# EAGLE schematic AK-230_24-V3 (EAGLE 5.10)
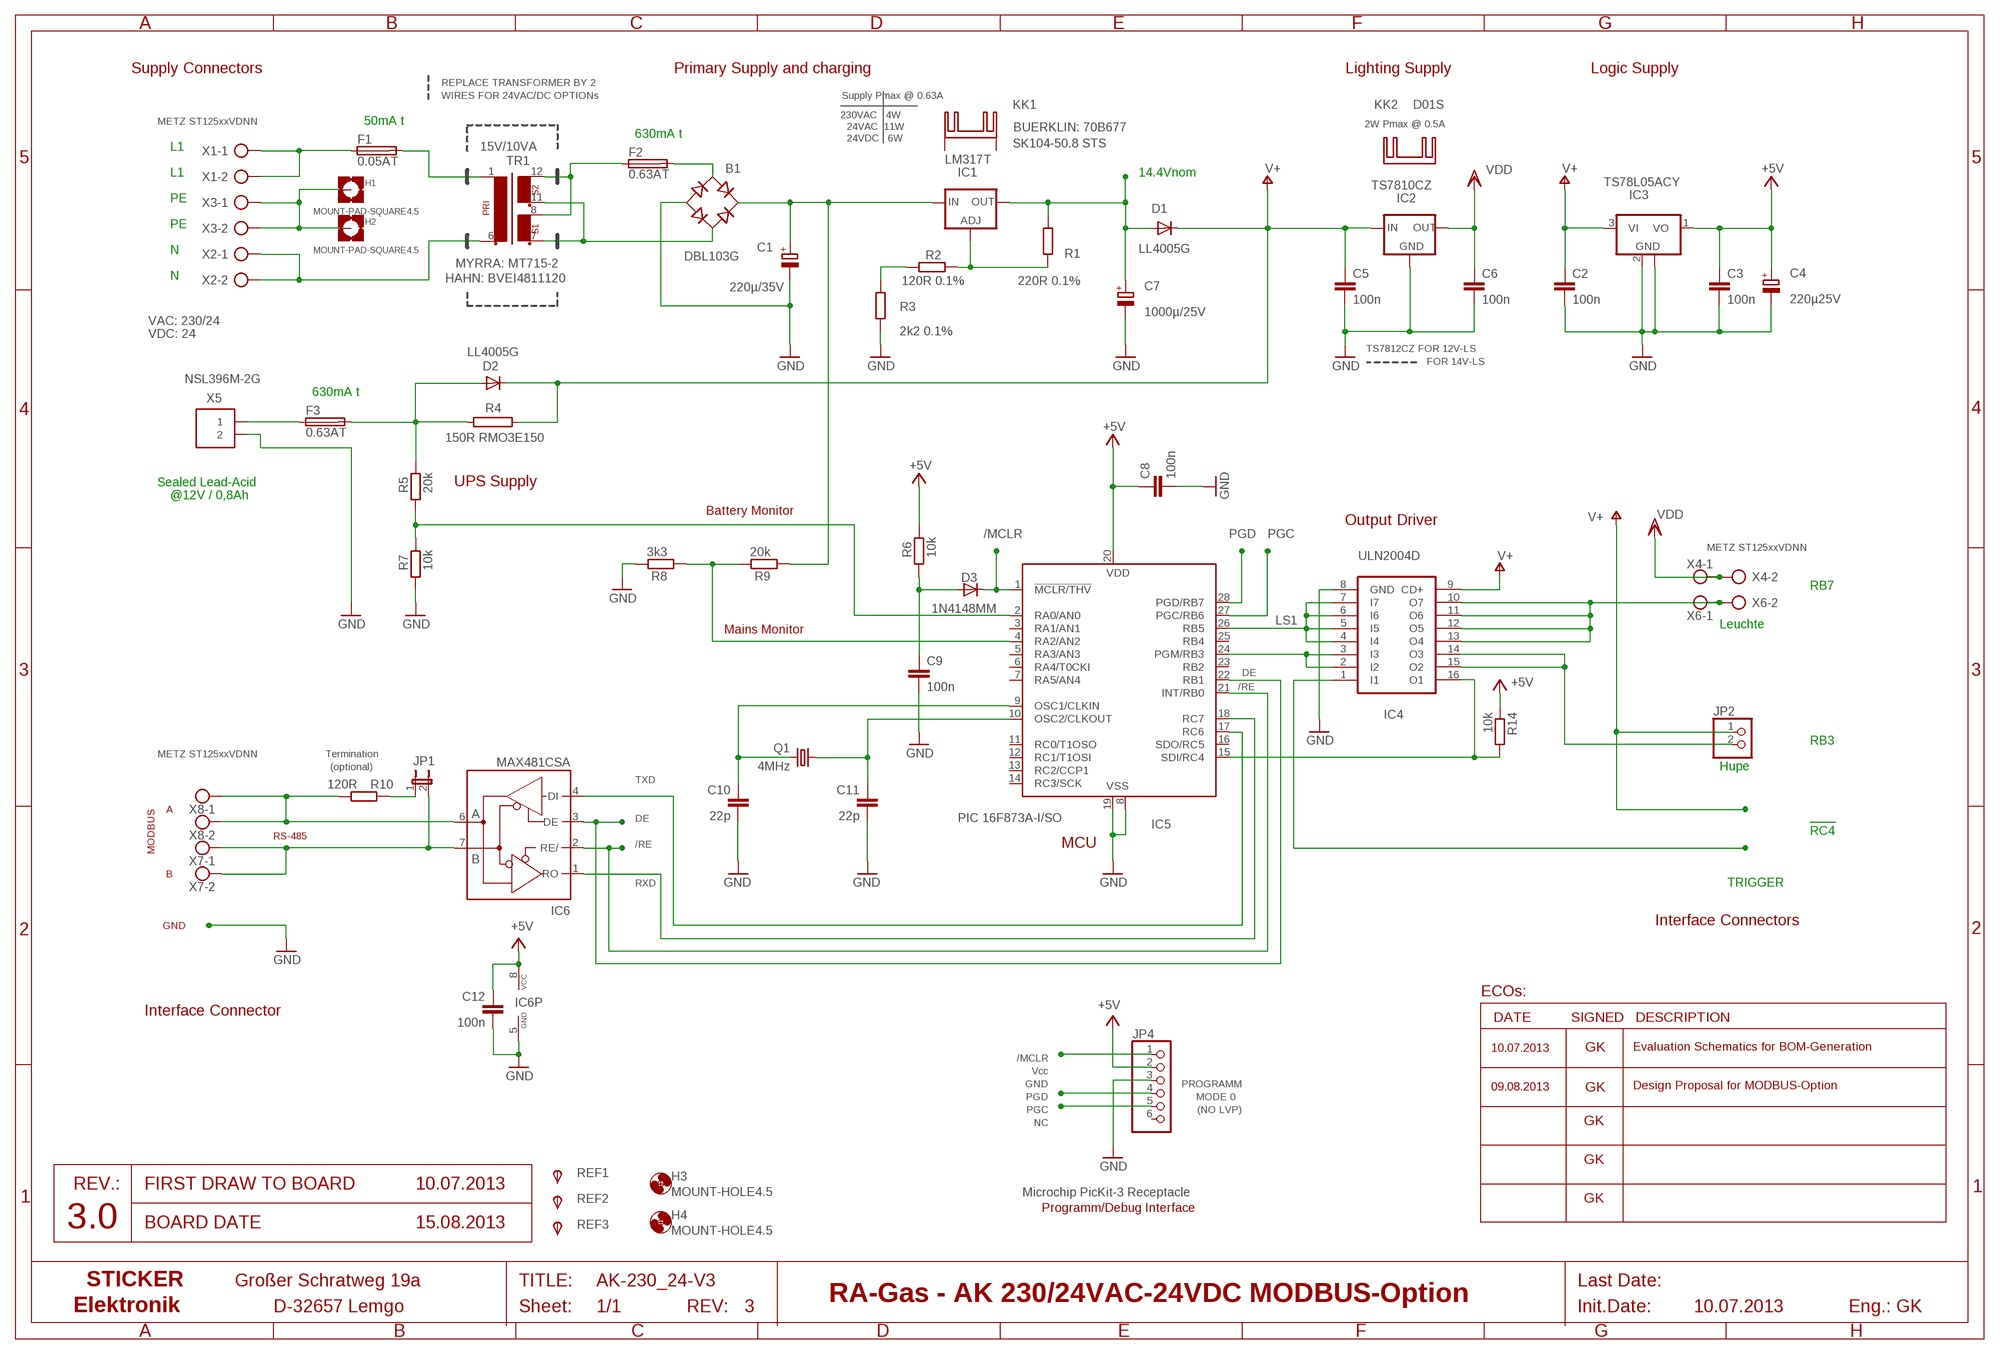
[diagram p0: schematic, sheet 1]

## Parts
B1  DBL103G  DBL203G  [DB]
C1  220µ/35V  CPOL-EUE5-10.5  [E5-10,5]
C2  100n  C-EUC1206  [C1206]
C3  100n  C-EUC1206  [C1206]
C4  220µ25V  CPOL-EUE3.5-8  [E3,5-8]
C5  100n  C-EUC1206  [C1206]
C6  100n  C-EUC1206  [C1206]
C7  1000µ/25V  CPOL-EUE5-10.5  [E5-10,5]
C8  100n  C-EUC1206  [C1206]
C9  100n  C-EUC1206  [C1206]
C10  22p  C-EUC0805  [C0805]
C11  22p  C-EUC0805  [C0805]
C12  100n  C-EUC1206  [C1206]
D1  LL4005G  DIODE-MELF-MLL41  [MELF-MLL41]
D2  LL4005G  DIODE-MELF-MLL41  [MELF-MLL41]
D3  1N4148MM  [MINIMELF@1]
F1  0.05AT  KS9V  [KS9V]
F2  0.63AT  KS9V  [KS9V]
F3  0.63AT  KS9V  [KS9V]
H1  MOUNT-PAD-SQUARE4.5  [4,5-PAD-SQUARE]
H2  MOUNT-PAD-SQUARE4.5  [4,5-PAD-SQUARE]
H3  MOUNT-HOLE4.5  [4,5]
H4  MOUNT-HOLE4.5  [4,5]
IC1  LM317T  LM317TS  [317TS]
IC2  TS7810CZ  78XXS  [78XXS]
IC3  TS78L05ACY  78L05F  [SOT89]
IC4  ULN2004D  ULN2004AD  [SO16]
IC5  PIC 16F873A-I/SO  PIC16873SO  [SO28W]
IC6  MAX481CSA  [SO08]
JP1  JP1E  [JP1]
JP2  PINHD-1X2  [1X02]
JP4  PINHD-1X6  [1X06]
KK1  SK104-50.8 STS  SK104-PAD  [SK104-PAD]
KK2  D01S  [D01S]
Q1  4MHz  CRYSTALHC49UP  [HC49UP]
R1  220R 0.1%  R-EU_R0805  [R0805]
R2  120R 0.1%  R-EU_R0805  [R0805]
R3  2k2 0.1%  R-EU_R0805  [R0805]
R4  150R RMO3E150  RKH206-8  [KH206-8]
R5  20k  R-EU_R1206  [R1206]
R6  10k  R-EU_R1206  [R1206]
R7  10k  R-EU_R1206  [R1206]
R8  3k3  R-EU_R1206  [R1206]
R9  20k  R-EU_R1206  [R1206]
R10  120R  R-EU_R1206  [R1206]
R14  10k  R-EU_R1206  [R1206]
REF1  TPSB1,27  [B1,27]
REF2  TPSB1,27  [B1,27]
REF3  TPSB1,27  [B1,27]
TR1  MYRRA: MT715-2  EI48-2B  [EI48-2B]
X1  AK500/2  [AK500/2]
X2  AK500/2  [AK500/2]
X3  AK500/2  [AK500/2]
X4  AK500/2  [AK500/2]
X5  NSL396M-2G  MKS1852-6-0-202  [MKS1852-6-0-202]
X6  AK500/2  [AK500/2]
X7  AK500/2  [AK500/2]
X8  AK500/2  [AK500/2]

## Nets
+5V: C3.1 C4.+ C8.1 C12.1 IC3.1(VO) IC5.20(VDD) IC6.8(VCC) JP4.2 R6.2 R14.1
/MCLR: D3.C IC5.1(!MCLR/THV) JP4.1
/RE: IC5.21(INT/RB0) IC6.2(RE/)
A: IC6.6(A) R10.2 X8.1 X8.2
B: IC6.7(B) JP1.2 X7.1 X7.2
DE: IC5.22(RB1) IC6.3(DE)
GND: B1.- C1.- C2.2 C3.2 C4.- C5.2 C6.2 C7.- C8.2 C9.2 C10.2 C11.2 C12.2 IC2.GND IC3.2(GND) IC3.2@1(GND) IC4.8(GND) IC5.8(VSS) IC5.19(VSS) IC6.5(GND) JP4.3 R3.1 R7.1 R8.2 X5.2
LS1: IC4.4(I4) IC4.5(I5) IC4.6(I6) IC4.7(I7) IC5.26(RB5)
N$1: B1.AC1 TR1.7 TR1.11
N$2: F2.1 TR1.8 TR1.12
N$4: F1.1 X1.1 X1.2
N$6: TR1.6 X2.1 X2.2
N$7: B1.+ C1.+ IC1.3(IN) R9.1
N$8: D2.A F3.2 R4.1 R5.2
N$9: F3.1 X5.1
N$10: IC1.1(ADJ) R1.1 R2.2
N$11: F1.2 TR1.1
N$12: C7.+ D1.A IC1.2(OUT) R1.2
N$13: R2.1 R3.2
N$14: B1.AC2 F2.2
N$18: JP1.1 R10.1
N$19: IC4.2(I2) IC4.3(I3) IC5.24(PGM/RB3)
N$22: C9.1 D3.A R6.1
N$23: C11.1 IC5.10(OSC2/CLKOUT) Q1.1
N$24: IC5.2(RA0/AN0) R5.1 R7.2
N$25: IC4.10(O7) IC4.11(O6) IC4.12(O5) IC4.13(O4) X6.1 X6.2
N$26: C10.1 IC5.9(OSC1/CLKIN) Q1.2
N$29: IC4.14(O3) IC4.15(O2) JP2.2
N$30: IC4.16(O1) IC5.15(SDI/RC4) R14.2
N$40: IC5.4(RA2/AN2) R8.1 R9.2
PE: H1.B4,5(MOUNT) H2.B4,5(MOUNT) X3.1 X3.2
PGC: IC5.27(PGC/RB6) JP4.5
PGD: IC5.28(PGD/RB7) JP4.4
RXD: IC5.18(RC7) IC6.1(RO)
TRIG: IC4.1(I1)
TXD: IC5.17(RC6) IC6.4(DI)
V+: C2.1 C5.1 D1.C D2.C IC2.IN IC3.3(VI) IC4.9(CD+) JP2.1 R4.2
VDD: C6.1 IC2.OUT X4.1 X4.2
Unconnected: IC5.3(RA1/AN1) IC5.5(RA3/AN3) IC5.6(RA4/T0CKI) IC5.7(RA5/AN4) IC5.11(RC0/T1OSO) IC5.12(RC1/T1OSI) IC5.13(RC2/CCP1) IC5.14(RC3/SCK) IC5.16(SDO/RC5) IC5.23(RB2) IC5.25(RB4) JP4.6 KK1.K1(K) KK1.K2(K) REF1.TP(PP) REF2.TP(PP) REF3.TP(PP)

## Notes on the sheet
- Supply Connectors | Primary Supply and charging | Lighting Supply | Logic Supply
- REPLACE TRANSFORMER BY 2
- WIRES FOR 24VAC/DC OPTIONs | Supply Pmax @ 0.63A
- 230VAC   4W
- METZ ST125xxVDNN | 50mA t | 2W Pmax @ 0.5A
- 24VAC  11W | BUERKLIN: 70B677
- 630mA t
- 24VDC   6W
- L1 | 15V/10VA
- L1 | 14.4Vnom
- PE
- PE
- N
- N | HAHN: BVEI4811120
- VAC: 230/24
- VDC: 24
- TS7812CZ FOR 12V-LS
- FOR 14V-LS
- 630mA t
- Sealed Lead-Acid | UPS Supply
- @12V / 0,8Ah
- Battery Monitor
- Output Driver
- METZ ST125xxVDNN
- RB7
- Leuchte
- Mains Monitor
- RB3
- METZ ST125xxVDNN | Termination
- (optional) | Hupe
- A
- RS-485 | RC4
- MCU
- MODBUS
- B
- TRIGGER
- Interface Connectors
- GND
- ECOs:
- Interface Connector
- DATE | SIGNED | DESCRIPTION
- 10.07.2013 | GK | Evaluation Schematics for BOM-Generation
- Vcc
- GND | PROGRAMM
- 09.08.2013 | GK | Design Proposal for MODBUS-Option
- MODE 0
- (NO LVP)
- NC
- GK
- GK
- REV.: | FIRST DRAW TO BOARD | 10.07.2013
- Microchip PicKit-3 Receptacle
- GK
- Programm/Debug Interface
- 3.0 | BOARD DATE | 15.08.2013
- RA-Gas - AK 230/24VAC-24VDC MODBUS-Option
- 3 | 10.07.2013

## Library data of the parts
B1 = rectifier:DB?*G: Single Phase 1.0 AMP Glass Passivated Bridge Rectifier Taiwan Semiconductor Co.,Ltd. - TSC Source: http://www.taiwansemi.com/TSCbig5/ezcatfiles/cust/img/img/db101g.pdf http://www.ts.com.tw/db/pictures/modules/PDT/PDT060207001/DBLS201G.pdf
C1 C4 C7 = rcl:CPOL-EU: POLARIZED CAPACITOR, European symbol
C2 C3 C5 C6 C8-C12 = rcl:C-EU: CAPACITOR, European symbol
D1 D2 = diode:DIODE-: DIODE
D3 = diode:1N4148: DIODE high speed (Philips)
F1-F3 = fuse:KS9V: FUSE HOLDER CS, Schukat
H1 H2 = holes:MOUNT-PAD-SQUARE: MOUNTING PAD, square
H3 H4 = holes:MOUNT-HOLE: MOUNTING HOLE with drill center marker
IC1 = v-reg:LM317TS: VOLTAGE REGULATOR
IC2 = v-reg:78XXS: VOLTAGE REGULATOR
IC3 = linear:78L*: POSITOIV-VOLTAGE REGULATORS Output up to 100 mA Source: http://focus.ti.com/lit/ds/symlink/ua78l05.pdf
IC4 = uln-udn:ULN2004A: DRIVER ARRAY
IC5 = microchip:PIC16*873: MICROCONTROLLER flash type
IC6 = maxim:MAX481CSA: RS485 TRANSEIVER
JP1 = jumper:JP1E: JUMPER
JP2 = pinhead:PINHD-1X2: PIN HEADER
JP4 = pinhead:PINHD-1X6: PIN HEADER
KK1 = heatsink:SK104-PAD: HEATSINK manufacturer Fischer/distributor Buerklin
KK2 = heatsink:D01S: HEATSINK distributor Schukat
Q1 = crystal:CRYSTAL: CRYSTAL
R1-R3 R5-R10 R14 = rcl:R-EU_: RESISTOR, European symbol
R4 = resistor-power:R: Power Resitor
REF1-REF3 = testpad:TPS: TEST PIN
TR1 = trafo:EI48-2B: TRANSFORMER 1 primary winding, 2 secondary windings, mounting holes ERA
X1-X4 X6-X8 = con-ptr500:AK500/2: CONNECTOR
X5 = con-stocko:MKS1852-6-0-202: Serie MKS 1850 Lötstifte In-line, Raster 2.5 mm, Stiftwannen, stehend, mit Rastlasche Source: http://www.stocko.de/de/index.php?seite=ka_rfk2_mks1850.html&rubrik=Katalog+-+RFK+2 rfk_1850.pdf